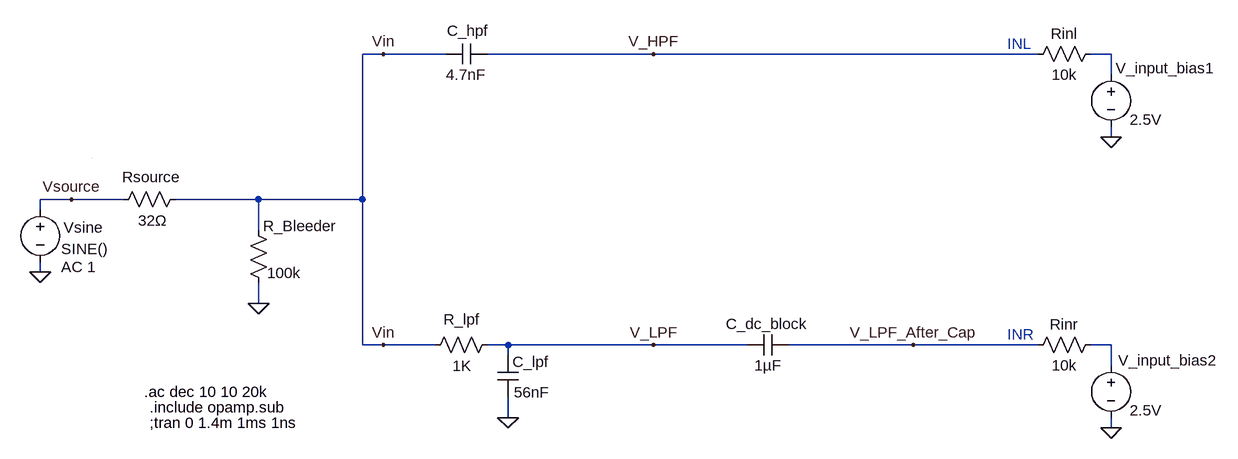
[diagram p0: schematic audio-crossover2.asc]
audio-crossover2.asc, the LTspice schematic file:
Version 4
SHEET 1 2344 2400
WIRE -1104 1648 -1136 1648
WIRE -1008 1648 -1104 1648
WIRE -688 1648 -944 1648
WIRE -96 1648 -688 1648
WIRE 16 1648 -16 1648
WIRE 16 1680 16 1648
WIRE 16 1776 16 1760
WIRE -1584 1872 -1632 1872
WIRE -1504 1872 -1584 1872
WIRE -1296 1872 -1424 1872
WIRE -1136 1872 -1136 1648
WIRE -1136 1872 -1296 1872
WIRE -1632 1888 -1632 1872
WIRE -1296 1920 -1296 1872
WIRE -1632 1984 -1632 1968
WIRE -1296 2032 -1296 2000
WIRE -1136 2096 -1136 1872
WIRE -1104 2096 -1136 2096
WIRE -1024 2096 -1104 2096
WIRE -912 2096 -944 2096
WIRE -688 2096 -912 2096
WIRE -544 2096 -688 2096
WIRE -288 2096 -480 2096
WIRE -96 2096 -288 2096
WIRE 16 2096 -16 2096
WIRE -912 2112 -912 2096
WIRE 16 2128 16 2096
WIRE -912 2208 -912 2176
WIRE 16 2224 16 2208
FLAG -912 2208 0
FLAG -1632 1984 0
FLAG -1584 1872 Vsource
FLAG 16 1776 0
FLAG -1104 1648 Vin
FLAG -688 1648 V_HPF
FLAG -1104 2096 Vin
FLAG -688 2096 V_LPF
FLAG -1296 2032 0
FLAG 16 2224 0
FLAG -288 2096 V_LPF_After_Cap
SYMBOL cap -928 2112 R0
WINDOW 3 25 57 Left 2
WINDOW 0 23 10 Left 2
SYMATTR Value 56nF
SYMATTR InstName C_lpf
SYMBOL res -928 2080 R90
WINDOW 0 -8 55 VBottom 2
WINDOW 3 33 55 VTop 2
SYMATTR InstName R_lpf
SYMATTR Value 1K
SYMBOL voltage -1632 1872 R0
WINDOW 0 36 43 Left 2
WINDOW 3 32 76 Left 2
WINDOW 123 32 104 Left 2
WINDOW 39 0 0 Left 0
SYMATTR InstName Vsine
SYMATTR Value SINE()
SYMATTR Value2 AC 1
SYMBOL res -1408 1856 R90
WINDOW 0 -3 53 VBottom 2
WINDOW 3 33 51 VTop 2
SYMATTR InstName Rsource
SYMATTR Value 32Ω
SYMBOL cap -944 1632 R90
WINDOW 3 32 32 VTop 2
WINDOW 0 -4 30 VBottom 2
SYMATTR Value 4.7nF
SYMATTR InstName C_hpf
SYMBOL cap -480 2080 R90
WINDOW 0 -1 34 VBottom 2
WINDOW 3 32 32 VTop 2
SYMATTR InstName C_dc_block
SYMATTR Value 1µF
SYMBOL res -1312 1904 R0
WINDOW 0 23 9 Left 2
WINDOW 3 29 81 Left 2
SYMATTR InstName R_Bleeder
SYMATTR Value 100k
SYMBOL res 0 1632 R90
WINDOW 0 0 56 VBottom 2
WINDOW 3 32 56 VTop 2
SYMATTR InstName Rinl
SYMATTR Value 10k
SYMBOL voltage 16 1664 R0
WINDOW 0 7 6 Left 2
WINDOW 3 29 85 Left 2
WINDOW 123 0 0 Left 0
WINDOW 39 0 0 Left 0
SYMATTR InstName V_input_bias1
SYMATTR Value 2.5V
SYMBOL res 0 2080 R90
WINDOW 0 0 56 VBottom 2
WINDOW 3 32 56 VTop 2
SYMATTR InstName Rinr
SYMATTR Value 10k
SYMBOL voltage 16 2112 R0
WINDOW 0 11 8 Left 2
WINDOW 3 29 85 Left 2
WINDOW 123 0 0 Left 0
WINDOW 39 0 0 Left 0
SYMATTR InstName V_input_bias2
SYMATTR Value 2.5V
TEXT -1472 2168 Left 2 !.ac dec 10 10 20k
TEXT -1464 2192 Left 2 !.include opamp.sub
TEXT -1464 2216 Left 2 !;tran 0 1.4m 1ms 1ns
TEXT -144 1632 Left 2 ;INL
TEXT -144 2080 Left 2 ;INR
LINE Normal -1552 1808 -1552 1808 2
LINE Normal -1552 1808 -1552 1808 2

The netlist it stands for:
* audio-crossover2.asc
C_lpf V_LPF 0 56nF
R_lpf V_LPF Vin 1K
Vsine Vsource 0 SINE() AC 1
Rsource Vin Vsource 32Ω
C_hpf V_HPF Vin 4.7nF
C_dc_block V_LPF_After_Cap V_LPF 1µF
R_Bleeder Vin 0 100k
Rinl N001 V_HPF 10k
V_input_bias1 N001 0 2.5V
Rinr N002 V_LPF_After_Cap 10k
V_input_bias2 N002 0 2.5V
.ac dec 10 10 20k
.include opamp.sub
;tran 0 1.4m 1ms 1ns
* INL
* INR
.backanno
.end